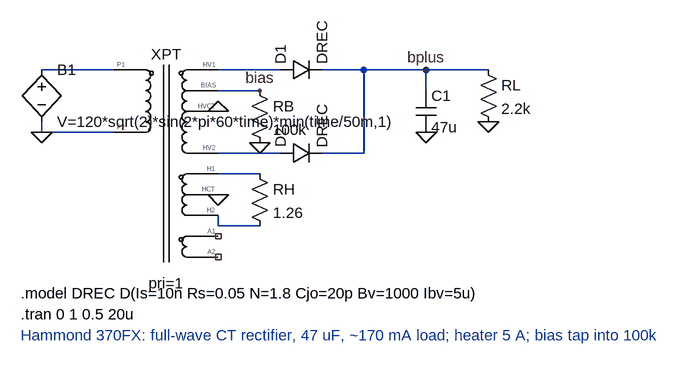
[diagram p0: schematic demo_mains-transformer.asc]
demo_mains-transformer.asc, the LTspice schematic file:
Version 4
SHEET 1 1200 560
WIRE 208 112 320 112
WIRE 208 208 320 208
WIRE 480 112 576 112
WIRE 480 240 576 240
WIRE 640 112 704 112
WIRE 640 240 704 240
WIRE 704 112 704 240
WIRE 704 112 800 112
WIRE 800 112 800 144
WIRE 800 112 896 112
WIRE 480 272 544 272
WIRE 480 336 480 352
WIRE 480 352 544 352
WIRE 480 144 544 144
WIRE 208 192 208 208
FLAG 208 208 0
FLAG 480 176 0
FLAG 800 208 0
FLAG 896 192 0
FLAG 480 304 0
FLAG 544 224 0
FLAG 800 112 bplus
FLAG 544 144 bias
SYMBOL bv 208 96 R0
SYMATTR InstName B1
SYMATTR Value V=120*sqrt(2)*sin(2*pi*60*time)*min(time/50m,1)
SYMBOL PT_370FX 320 96 R0
SYMATTR InstName XPT
SYMATTR Value pri=1
SYMBOL diode 576 128 R270
SYMATTR InstName D1
SYMATTR Value DREC
SYMBOL diode 576 256 R270
SYMATTR InstName D2
SYMATTR Value DREC
SYMBOL cap 784 144 R0
SYMATTR InstName C1
SYMATTR Value 47u
SYMBOL res 880 96 R0
SYMATTR InstName RL
SYMATTR Value 2.2k
SYMBOL res 528 128 R0
SYMATTR InstName RB
SYMATTR Value 100k
SYMBOL res 528 256 R0
SYMATTR InstName RH
SYMATTR Value 1.26
TEXT 176 456 Left 2 !.model DREC D(Is=10n Rs=0.05 N=1.8 Cjo=20p Bv=1000 Ibv=5u)
TEXT 176 488 Left 2 !.tran 0 1 0.5 20u
TEXT 176 520 Left 2 ;Hammond 370FX: full-wave CT rectifier, 47 uF, ~170 mA load; heater 5 A; bias tap into 100k

The netlist it stands for:
* demo_mains-transformer.asc
B1 N001 0 V=120*sqrt(2)*sin(2*pi*60*time)*min(time/50m,1)
XXPT N001 0 N002 bias 0 N003 N004 0 N005 NC_01 NC_02 PT_370FX pri=1  ; pins P1 P2 HV1 BIAS HVCT HV2 H1 HCT H2 A1 A2
D1 N002 bplus DREC
D2 N003 bplus DREC
C1 bplus 0 47u
RL bplus 0 2.2k
RB bias 0 100k
RH N004 N005 1.26
.model D D
.lib standard.dio
.model DREC D(Is=10n Rs=0.05 N=1.8 Cjo=20p Bv=1000 Ibv=5u)
.tran 0 1 0.5 20u
* Hammond 370FX: full-wave CT rectifier, 47 uF, ~170 mA load; heater 5 A; bias tap into 100k
.lib mains-transformer.sub
.backanno
.end